# Altium schematic sheet besc drive sch.SchDoc
size A4
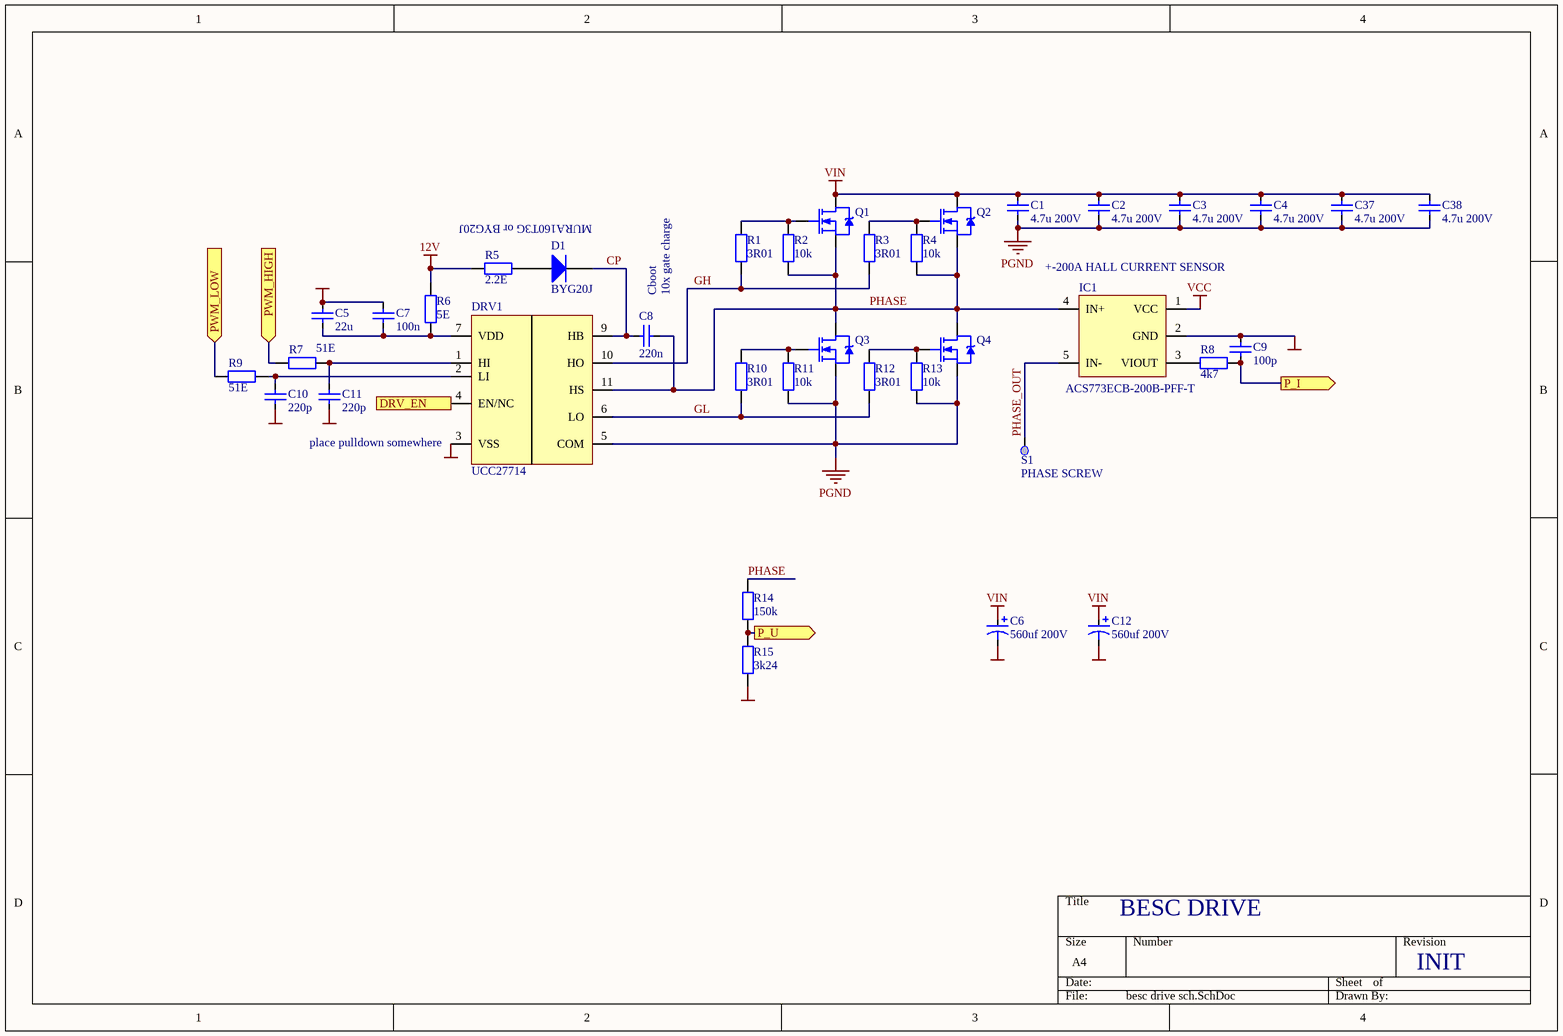
[diagram p0: besc drive sch.SchDoc]

## Parts
C1  4.7u 200V  [CAP 2220/5650 3.3MM]
C2  4.7u 200V  [CAP 2220/5650 3.3MM]
C3  4.7u 200V  [CAP 2220/5650 3.3MM]
C4  4.7u 200V  [CAP 2220/5650 3.3MM]
C5  22u  [0805]
C6  560uf 200V  [ELKO_18x40_90deg]
C7  100n  [0603]
C8  220n  [0603]
C9  100p  [0603]
C10  220p  [0402]
C11  220p  [0402]
C12  560uf 200V  [ELKO_18x40_90deg]
C37  4.7u 200V  [CAP 2220/5650 3.3MM]
C38  4.7u 200V  [CAP 2220/5650 3.3MM]
D1  BYG20J  [DO-214AC]
DRV1  UCC27714  [SOIC14_M]
IC1  ACS773ECB-200B-PFF-T  [ACS758]
Q1  IPB044N15N5  [Dpak-7]  (value not drawn)
Q2  IPB044N15N5  [Dpak-7]  (value not drawn)
Q3  IPB044N15N5  [Dpak-7]  (value not drawn)
Q4  IPB044N15N5  [Dpak-7]  (value not drawn)
R1  3R01  [0603]
R2  10k  [0603]
R3  3R01  [0603]
R4  10k  [0603]
R5  2.2E  [1210]
R6  5E  [0603]
R7  51E  [0402]
R8  4k7  [0603]
R9  51E  [0402]
R10  3R01  [0603]
R11  10k  [0603]
R12  3R01  [0603]
R13  10k  [0603]
R14  150k  [0805]
R15  3k24  [0402]
S1  PHASE SCREW  [WP-SHFU-M6]

## Ports
DRV_EN (in), P_I (out), P_U (out), PWM_HIGH (in), PWM_LOW (in)

## Nets
12V: R5.2 R6.1
LGND: C5.2 C7.2 C9.2 C10.2 C11.2 DRV1.3(VSS) IC1.2(GND) R15.2
PGND: C1.1 C2.1 C3.1 C4.1 C6.2 C12.2 C37.1 C38.1 DRV1.5(COM) Q3.2(S) Q4.2(S) R11.2 R13.2
VCC: IC1.1(VCC)
VIN: C1.2 C2.2 C3.2 C4.2 C6.1 C12.1 C37.2 C38.2 Q1.3(D) Q2.3(D)
CP: C8.2 D1.2(K) DRV1.9(HB)
DRV_EN: DRV1.4(EN/NC) ; port DRV_EN
GH: DRV1.10(HO) R1.2 R3.2
GL: DRV1.6(LO) R10.2 R12.2
P_I: C9.1 R8.1 ; port P_I
P_U: R14.2 R15.1 ; port P_U
PHASE: C8.1 DRV1.11(HS) IC1.4(IN+) Q1.2(S) Q2.2(S) Q3.3(D) Q4.3(D) R2.2 R4.2 R14.1
PHASE_OUT: IC1.5(IN-) S1.1
PWM_HIGH: R7.2 ; port PWM_HIGH
PWM_LOW: R9.1 ; port PWM_LOW
NetC5_1: C5.1 C7.1 DRV1.7(VDD) R6.2
NetC10_1: C10.1 DRV1.2(LI) R9.2
NetC11_1: C11.1 DRV1.1(HI) R7.1
NetD1_1: D1.1(A) R5.1
NetIC1_3: IC1.3(VIOUT) R8.2
NetQ1_1: Q1.1(G) R1.1 R2.1
NetQ2_1: Q2.1(G) R3.1 R4.1
NetQ3_1: Q3.1(G) R10.1 R11.1
NetQ4_1: Q4.1(G) R12.1 R13.1

Not connected (* = marked no-connect by the designer): DRV1 8(NC) 12(NC) 13(NC) 14(NC)

## Notes on the sheet
- MURA160T3G or BYG20J
- (near C8) Cboot
- (near C8) 10x gate charge
- +-200A HALL CURRENT SENSOR
- (near DRV1) place pulldown somewhere
- BESC DRIVE
- INIT

## Library data of the parts
C1-C5 C7-C11 C37 C38 = cap: Capacitor; Published: 8-Jun-2000; LatestRevisionDate: 17-Jul-2002; LatestRevisionNote: Re-released for DXP Platform.; PackageReference: RAD-0.3; Publisher: Altium Limited; PackageDescription: Radial Cap, Thru-Hole; 2 Leads; 0.3 in Pin Spacing
  C1: url: https://www.aliexpress.com/item/5pcs-SMD-capacitor-5750-2220-4-7UF-200V-250V-475K-X7R-10-Non-polarity/32633946304.html?spm=2114.search0104.3.15.470c328aPXtbgJ&ws_ab_test=searchweb0_0,searchweb201602_1_10065_10068_318_319_5731311_317_10696_5728811_10084_10083_10618_452_10304_10307_5731411_10820_532_10301_10821_5731211_5731111_204_328_10059_10884_323_10887_5731511_100031_5731611_320_321_322_5731711_10103,searchweb201603_55,ppcSwitch_0&algo_expid=2440df57-4916-4206-b13e-2c99e03a8745-2&algo_pvid=2440df57-4916-4206-b13e-2c99e03a8745
C6 C12 = Cap Pol1: Polarized Capacitor (Radial); Published: 8-Jun-2000; LatestRevisionDate: 17-Jul-2002; LatestRevisionNote: Re-released for DXP Platform.; PackageReference: RB7.6-15; Publisher: Altium Limited; PackageDescription: Polarized Capacitor (Radial); 2 Leads
D1 = Diode 1N4148: High Conductance Fast Diode; Published: 8-Jun-2000; LatestRevisionDate: 17-Jul-2002; LatestRevisionNote: Re-released for DXP Platform.; DatasheetVersion: 1997; PackageReference: DO-35; Publisher: Altium Limited; PackageDescription: Diode, Axial; Body 3.8 x 1.9 mm (LxDia. max), Lead Dia. 0.53 mm (max); Code_JEDEC: DO-204-AH; ComponentLink1Description: Manufacturer Link; ComponentLink1URL: http://www.fairchildsemi.com/; ComponentLink2Description: Datasheet; ComponentLink2URL: http://www.fairchildsemi.com/ds/1N%2F1N4148.pdf
IC1 = ACS758
Q1-Q4 = NMOS-2: N-Channel Power MOSFET; Note: Pin 2 is electrically connected to pin 4.; Published: 8-Jun-2000; LatestRevisionDate: 17-Jul-2002; LatestRevisionNote: Re-released for DXP Platform.; DatasheetVersion: PD-9.814; PackageVersion: Feb-1997; PackageReference: TO-220AB; Publisher: Altium Limited; PackageDescription: TO, Thru-Hole, Vertical, Heatsink Mounted; 3 In-Line Leads; Pitch 2.54 mm; ComponentLink1Description: Manufacturer Link; ComponentLink1URL: http://www.irf.com/
R1-R13 R15 = Res2: Resistor; Published: 8-Jun-2000; LatestRevisionDate: 17-Jul-2002; LatestRevisionNote: Re-released for DXP Platform.; PackageReference: AXIAL-0.4; Publisher: Altium Limited; PackageDescription: Axial Device, Thru-Hole; 2 Leads; 0.4 in Pin Spacing
R14 = Res2: 250 mW 0805; Published: 8-Jun-2000; LatestRevisionDate: 17-Jul-2002; LatestRevisionNote: Re-released for DXP Platform.; PackageReference: AXIAL-0.4; Publisher: Altium Limited; PackageDescription: Axial Device, Thru-Hole; 2 Leads; 0.4 in Pin Spacing
S1 = En_pin: 7461098